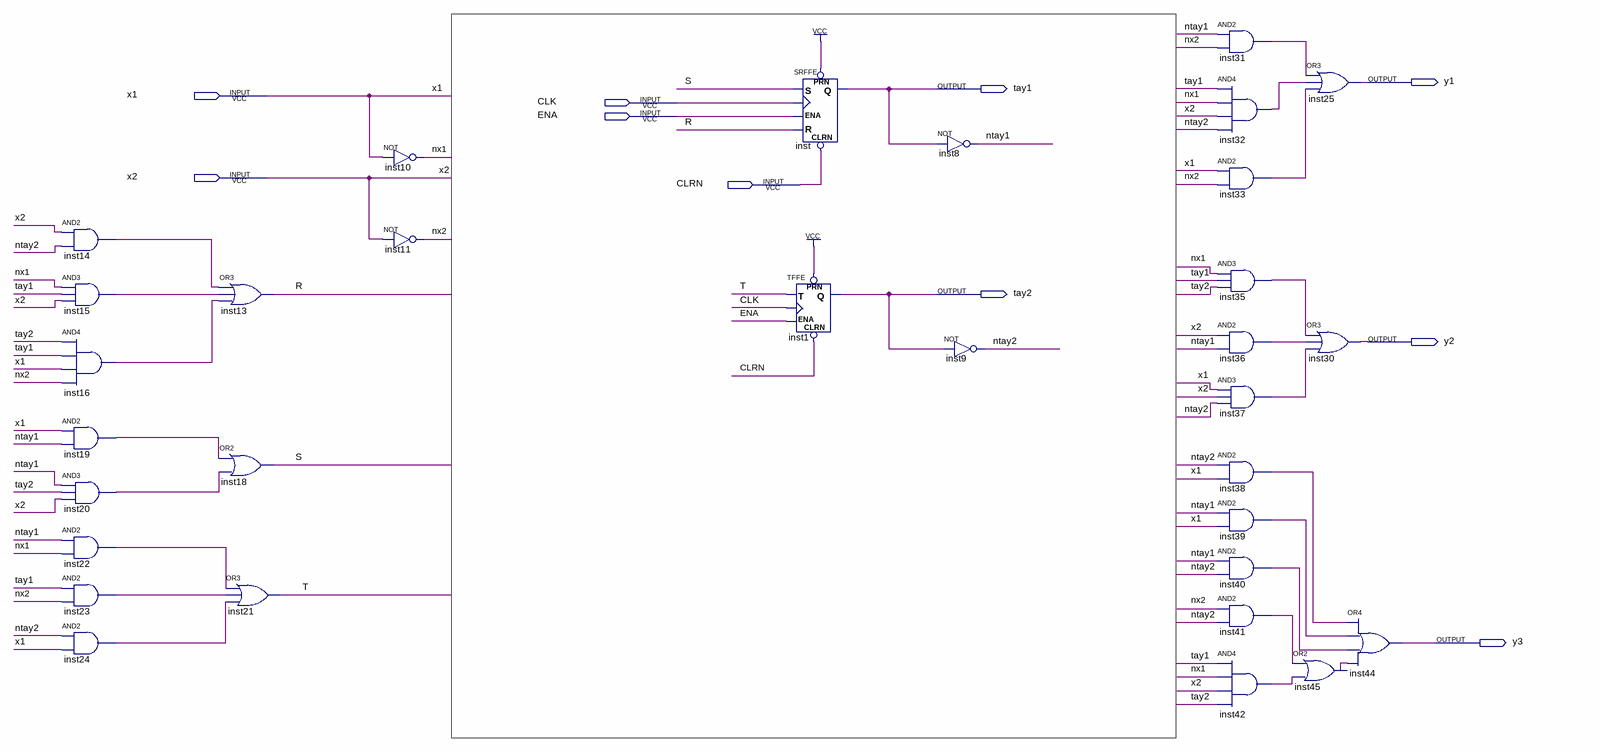
[diagram p0: schematic sheet]
// Quartus schematic meely.bdf as structural Verilog: 32 symbols, 10 pins
module meely (
  input  x1,
  input  CLK,
  input  ENA,
  input  x2,
  input  CLRN,
  output y1,
  output tay1,
  output tay2,
  output y2,
  output y3
);

  wire inst14_out, inst15_out, inst16_out, inst19_out, inst20_out, inst22_out, inst23_out, inst24_out,
       inst31_out, inst32_out, inst33_out, inst35_out, inst36_out, inst37_out, inst38_out, inst39_out,
       inst40_out, inst41_out, inst42_out, inst45_out, ntay1, ntay2, nx1, nx2, R, S, T;

  and inst14 (inst14_out, x2, ntay2);
  and inst15 (inst15_out, nx1, tay1, x2);
  and inst16 (inst16_out, tay2, tay1, x1, nx2);
  and inst19 (inst19_out, x1, ntay1);
  and inst20 (inst20_out, ntay1, tay2, x2);
  and inst22 (inst22_out, ntay1, nx1);
  and inst23 (inst23_out, tay1, nx2);
  and inst24 (inst24_out, ntay2, x1);
  or inst13 (R, inst14_out, inst15_out, inst16_out);
  or inst18 (S, inst19_out, inst20_out);
  or inst21 (T, inst22_out, inst23_out, inst24_out);
  not inst10 (nx1, x1);
  not inst11 (nx2, x2);
  SRFFE inst (.PRN(1'b1), .S(S), .CLK(CLK), .CLRN(CLRN), .R(R), .ENA(ENA), .Q(tay1));
  TFFE inst1 (.CLRN(CLRN), .T(T), .CLK(CLK), .ENA(ENA), .PRN(1'b1), .Q(tay2));
  not inst8 (ntay1, tay1);
  not inst9 (ntay2, tay2);
  and inst31 (inst31_out, ntay1, nx2);
  and inst32 (inst32_out, tay1, nx1, x2, ntay2);
  and inst33 (inst33_out, x1, nx2);
  and inst35 (inst35_out, nx1, tay1, tay2);
  and inst36 (inst36_out, x2, ntay1);
  and inst37 (inst37_out, x1, x2, ntay2);
  and inst38 (inst38_out, ntay2, x1);
  and inst39 (inst39_out, ntay1, x1);
  and inst40 (inst40_out, ntay1, ntay2);
  and inst41 (inst41_out, nx2, ntay2);
  and inst42 (inst42_out, tay1, nx1, x2, tay2);
  or inst25 (y1, inst31_out, inst32_out, inst33_out);
  or inst30 (y2, inst35_out, inst36_out, inst37_out);
  or inst45 (inst45_out, inst41_out, inst42_out);
  or inst44 (y3, inst38_out, inst39_out, inst40_out, inst45_out);
endmodule
